# Altium schematic sheet sch copy.schdoc
size 303 x 197 mm
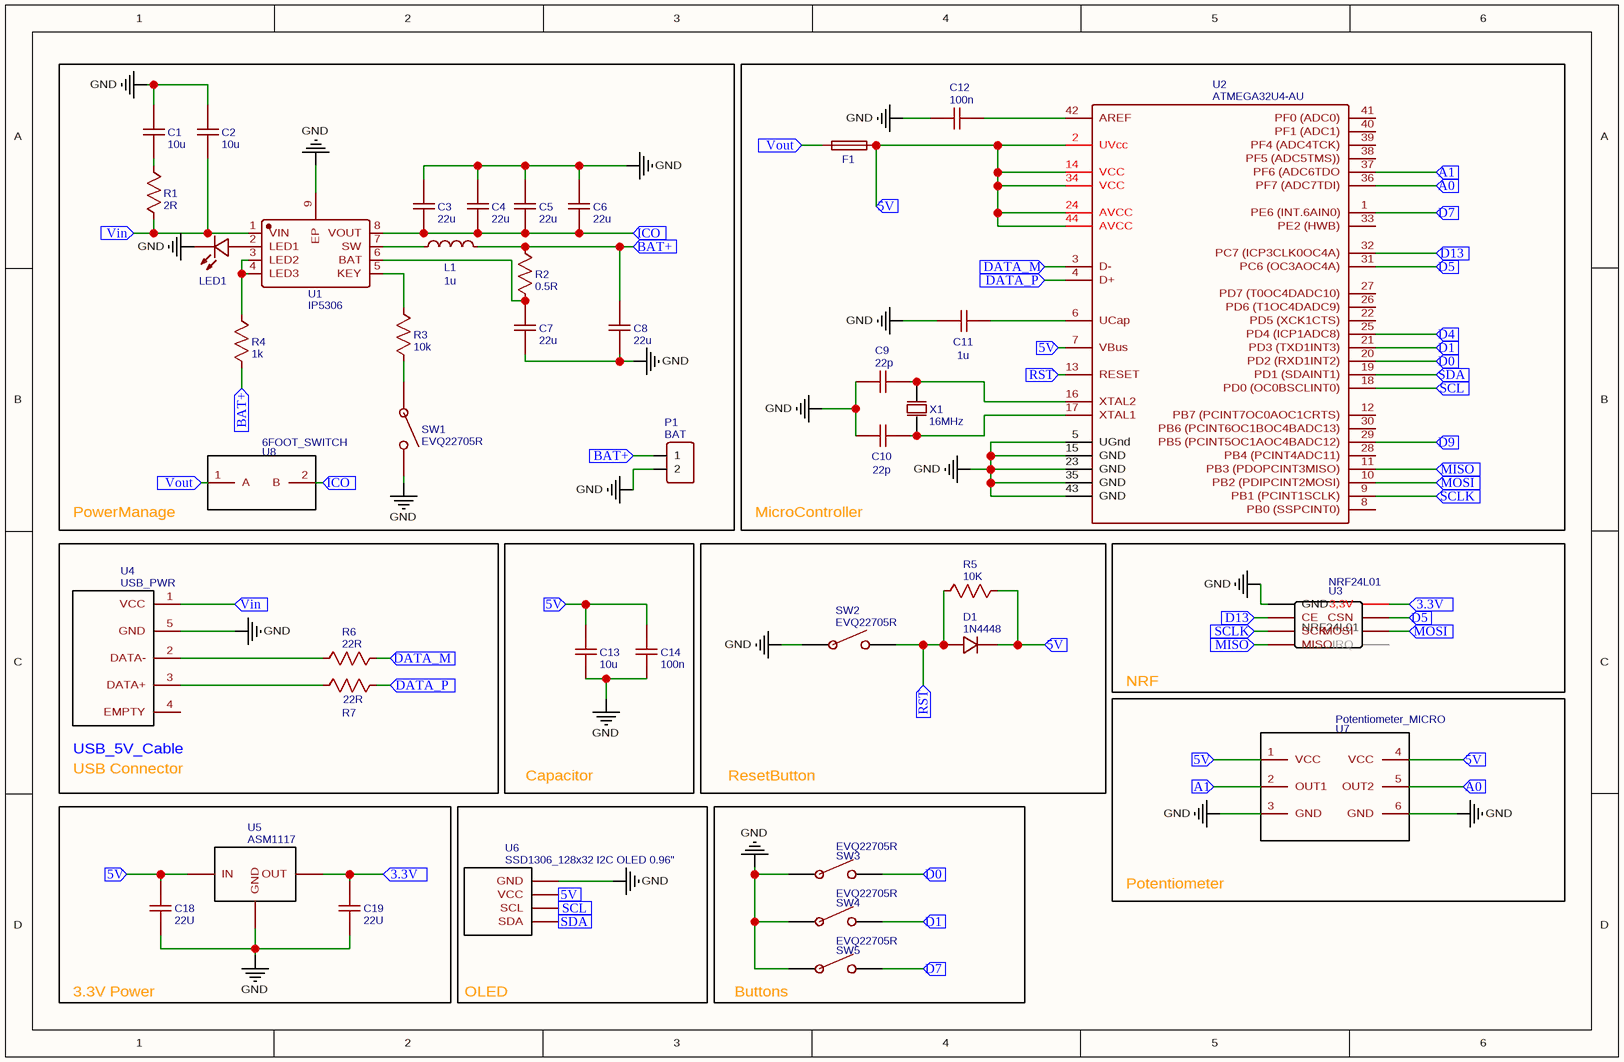
[diagram p0: sch copy.schdoc]

## Parts
C1  10u  [C0603]
C2  10u  [C0603]
C3  22u  [C0603]
C4  22u  [C0603]
C5  22u  [C0603]
C6  22u  [C0603]
C7  22u  [C0603]
C8  22u  [C0603]
C9  22p  [C0603]
C10  22p  [C0603]
C11  1u  [C0603]
C12  100n  [C0603]
C13  10u  [C0603]
C14  100n  [C0603]
C18  22U  [C0603]
C19  22U  [C0603]
D1  1N4448  [LED1206-R-RD]
F1  Glass tube fuse2A 3F 250VAC  [FUSE_SMD1206_REFLOW]  (value not drawn)
L1  1u  [C0805]
LED1  LTST-C170TBKT  [LED-0805]  (value not drawn)
P1  BAT  [HDR-1X2/2.54]
R1  2R  [R0603]
R2  0.5R  [R0603]
R3  10k  [R0603]
R4  1k  [R0603]
R5  10K  [R0603]
R6  22R  [R0603]
R7  22R  [R0603]
SW1  EVQ22705R  [SMT_BUTTON]
SW2  EVQ22705R  [SMT_BUTTON]
SW3  EVQ22705R  [KEY-6.0*6.0-4]
SW4  EVQ22705R  [KEY-6.0*6.0-4]
SW5  EVQ22705R  [KEY-6.0*6.0-4]
U1  IP5306  [ESOP-8_L4.9-W3.9-P1.27-LS6.0-BL-EP]
U2  ATMEGA32U4-AU  [QFP-44_10X10X08P]
U3  NRF24L01  [NRF_]
U4  USB_PWR  [MICROUSB]
U5  ASM1117  [SOT223]
U6  SSD1306_128x32 I2C OLED 0.96"  [SSD1306_128X32]
U7  Potentiometer_MICRO  [POINTMERER_MICRO]
U8  6FOOT_SWITCH  [6FOOT_SWITCH]
X1  16MHz  [HC-49S]

## Blocks framed on the sheet
PowerManage: C1-C8 L1 LED1 P1 R1-R4 SW1 U1 U8
MicroController: C9-C12 F1 U2 X1
USB Connector: R6 R7 U4
Capacitor: C13 C14
ResetButton: D1 R5 SW2
NRF: U3
Potentiometer: U7
3.3V Power: C18 C19 U5
OLED: U6
Buttons: SW3-SW5

## Ports
3.3V (in), 5V (in), A0 (in), A1 (in), BAT+ (in), D0 (in), D1 (in), D4 (in), D5 (in), D7 (in), D9 (in), D13 (in), DATA_M (in), DATA_P (in), ICO (in), MISO (in), MOSI (in), RST (in), SCL (in), SCLK (in), SDA (in), Vin (in), Vout (in)

## Nets
GND: C1.2 C2.2 C3.2 C4.2 C5.2 C6.2 C7.1 C8.1 C9.1 C10.1 C11.2 C12.2 C13.1 C14.1 C18.1 C19.1 LED1.2(K) P1.2 SW1.2 SW2.1 SW3.1 SW4.1 SW5.1 U1.9(EP) U2.5(UGnd) U2.15(GND) U2.23(GND) U2.35(GND) U2.43(GND) U3.1(GND) U4.5(GND) U5.1(GND) U6.4(GND) U7.3(GND) U7.6(GND)
3.3V: C19.2 U3.2(3,3V) U5.2(OUT) ; port 3.3V
5V: C13.2 C14.2 C18.2 D1.2(K) F1.2 R5.2 U2.2(UVcc) U2.7(VBus) U2.14(VCC) U2.24(AVCC) U2.34(VCC) U2.44(AVCC) U5.3(IN) U6.3(VCC) U7.1(VCC) U7.4(VCC) ; port 5V
A0: U2.36(PF7_(ADC7TDI)) U7.5(OUT2) ; port A0
A1: U2.37(PF6_(ADC6TDO) U7.2(OUT1) ; port A1
BAT+: C8.2 L1.2 P1.1 R2.2 R4.1 ; port BAT+
D0: SW3.2 U2.20(PD2_(RXD1INT2)) ; port D0
D1: SW4.2 U2.21(PD3_(TXD1INT3)) ; port D1
D4: U2.25(PD4_(ICP1ADC8)) ; port D4
D5: U2.31(PC6_(OC3AOC4A)) U3.4(CSN) ; port D5
D7: SW5.2 U2.1(PE6_(INT.6AIN0)) ; port D7
D9: U2.29(PB5_(PCINT5OC1AOC4BADC12)) ; port D9
D13: U2.32(PC7_(ICP3CLK0OC4A)) U3.3(CE) ; port D13
DATA_M: R6.2 U2.3(D-) ; port DATA_M
DATA_P: R7.2 U2.4(D+) ; port DATA_P
ICO: C3.1 C4.1 C5.1 C6.1 U1.8(VOUT) U8.2(B) ; port ICO
MISO: U2.11(PB3_(PDOPCINT3MISO)) U3.7(MISO) ; port MISO
MOSI: U2.10(PB2_(PDIPCINT2MOSI)) U3.6(MOSI) ; port MOSI
RST: D1.1(A) R5.1 SW2.2 U2.13(RESET) ; port RST
SCL: U2.18(PD0_(OC0BSCLINT0)) U6.2(SCL) ; port SCL
SCLK: U2.9(PB1_(PCINT1SCLK)) U3.5(SCK) ; port SCLK
SDA: U2.19(PD1_(SDAINT1)) U6.1(SDA) ; port SDA
Vin: C2.1 R1.1 U1.1(VIN) U4.1(VCC) ; port Vin
Vout: F1.1 U8.1(A) ; port Vout
NetC1_1: C1.1 R1.2
NetC7_2: C7.2 R2.1 U1.6(BAT)
NetC9_2: C9.2 U2.16(XTAL2) X1.1(OSC1)
NetC10_2: C10.2 U2.17(XTAL1) X1.2(OSC2)
NetC11_1: C11.1 U2.6(UCap)
NetC12_1: C12.1 U2.42(AREF)
NetL1_1: L1.1 U1.7(SW)
NetLED1_1: LED1.1(A) U1.2(LED1)
NetR3_1: R3.1 SW1.1
NetR3_2: R3.2 U1.5(KEY)
NetR4_2: R4.2 U1.3(LED2) U1.4(LED3)
NetR6_1: R6.1 U4.2(DATA-)
NetR7_1: R7.1 U4.3(DATA+)

Not connected (* = marked no-connect by the designer): U2 8(PB0_(SSPCINT0)) 12(PB7_(PCINT7OC0AOC1CRTS)) 22(PD5_(XCK1CTS)) 26(PD6_(T1OC4DADC9)) 27(PD7_(T0OC4DADC10)) 28(PB4_(PCINT4ADC11)) 30(PB6_(PCINT6OC1BOC4BADC13)) 33(PE2_(HWB)) 38(PF5_(ADC5TMS))) 39(PF4_(ADC4TCK)) 40(PF1_(ADC1)) 41(PF0_(ADC0)); U3 8(IRQ); U4 4(EMPTY)

## Notes on the sheet
- (in symbol USB_PWR) USB_5V_Cable

## Library data of the parts
C1 C2 C13 = 10u: nameAlias: Value(F); spicePre: C; spiceSymbolName: Cap_RAD-0.1_US
C3-C8 = 22u: nameAlias: Value(F); spicePre: C; spiceSymbolName: Cap_RAD-0.1_US
C9 C10 = 22p: nameAlias: Value(F); spicePre: C; spiceSymbolName: Cap_RAD-0.1_US
C11 = 1u: nameAlias: Value(F); spicePre: C; spiceSymbolName: Cap_RAD-0.1_US
C12 C14 = 100n: nameAlias: Value(F); spicePre: C; spiceSymbolName: Cap_RAD-0.1_US
C18 C19 = 22U: nameAlias: Value(F); spicePre: C; spiceSymbolName: Cap_RAD-0.1_US
D1 = 1N4448: BOM_Manufacturer: SEMTECH; BOM_Supplier: LCSC; BOM_Manufacturer Part: 1N4448; image: //image.lceda.cn/szlcsc/C54037.jpg; BOM_Supplier Part: C54037; spicePre: D; spiceSymbolName: 1N4448
F1 = Glass tube fuse2A 3F 250VAC: BOM_Manufacturer: XCFuse; BOM_Supplier: LCSC; BOM_Manufacturer Part: Glass tube fuse2A 3F 250VAC; image: //image.lceda.cn/szlcsc/C71017.jpg; BOM_Supplier Part: C71017; spicePre: F; spiceSymbolName: Glass tube fuse2A 3F 250VAC
L1 = 1u: nameAlias: Value(H); spicePre: L; spiceSymbolName: Inductor_AXIAL-0.4_US
LED1 = LTST-C170TBKT: BOM_Manufacturer: LITEON; Contributor: LCSC; BOM_Supplier: LCSC; BOM_Manufacturer Part: LTST-C170TBKT; BOM_Supplier Part: C98222; spicePre: L
P1 = BAT: BOM_Manufacturer: BOOMELE; BOM_Manufacturer Part: 2.54-1*2PFemale; BOM_Supplier: LCSC; image: //image.lceda.cn/szlcsc/C49661.jpg; BOM_Supplier Part: C49661; spicePre: P
R1 = 2R: nameAlias: Value(Ω); spicePre: R; spiceSymbolName: Res_AXIAL-0.3(1/8W)_US
R2 = 0.5R: nameAlias: Value(Ω); spicePre: R; spiceSymbolName: Res_AXIAL-0.3(1/8W)_US
R3 = 10k: nameAlias: Value(Ω); spicePre: R; spiceSymbolName: Res_AXIAL-0.3(1/8W)_US
R4 = 1k: nameAlias: Value(Ω); spicePre: R; spiceSymbolName: Res_AXIAL-0.3(1/8W)_US
R5 = 10K: nameAlias: Value(Ω); spicePre: R; spiceSymbolName: Res_AXIAL-0.3(1/8W)_US
R6 R7 = 22R: nameAlias: Value(Ω); spicePre: R; spiceSymbolName: Res_AXIAL-0.3(1/8W)_US
SW1-SW5 = EVQ22705R: BOM_Manufacturer: PANASONIC; Contributor: LCSC; BOM_Supplier: LCSC; BOM_Manufacturer Part: EVQ22705R; BOM_Supplier Part: C79156; spicePre: S
  SW1 SW3-SW5: spiceSymbolName: EVQ22705R
U1 = IP5306: BOM_Manufacturer: INJOINIC; Contributor: LCSC; BOM_Supplier: LCSC; BOM_Supplier Part: C181692; BOM_Manufacturer Part: IP5306; spicePre: U; spiceSymbolName: IP5306
U2 = ATMEGA32U4-AU: BOM_Manufacturer: MICROCHIP; SMT Type: Extend; BOM_Supplier: LCSC; BOM_Manufacturer Part: ATMEGA32U4-AU; image: //image.lceda.cn/szlcsc/C44854.jpg; BOM_Supplier Part: C44854; BOM_LCSC Assembly: Yes; spicePre: U; spiceSymbolName: ATMEGA32U4-AU
U3 = NRF24L01: Contributor: lukasztolak; BOM_Manufacturer Part: NRF24L01; spicePre: U; spiceSymbolName: NRF24L01
U4 = USB_PWR: Contributor: Dimsmary; spicePre: U; spiceSymbolName: USB_PWR
U5 = ASM1117: Contributor: xsu; sourceId: c4DdNLlVS; timeStamp: 1462596864; spicePre: U; spiceSymbolName: ASM1117
U6 = SSD1306_128x32 I2C OLED 0.96": Contributor: Xyster; BOM_Manufacturer Part: SSD1306_128x32 I2C OLED 0.96"; spicePre: U; spiceSymbolName: SSD1306_128x32 I2C OLED 0.96"
U7 = Potentiometer_MICRO: Contributor: Dimsmary; spicePre: U; spiceSymbolName: POINTIMETER_MICRO
U8 = 6FOOT_SWITCH: Contributor: Dimsmary; spicePre: U; spiceSymbolName: 6FOOT_SWITCH
X1 = 16MHz: BOM_Manufacturer: HOSONIC; BOM_Manufacturer Part: E49A16E00000KE10CO; nameAlias: Frequency; BOM_Supplier: LCSC; BOM_Supplier Part: C114981; spicePre: X; spiceSymbolName: E49A16E00000KE10CO